# Altium schematic sheet Relay_Schematic_w_headers.SchDoc
size A4; Date: 24/10; Author: Rami Abdelmotalib; DocumentName: Relay circuit
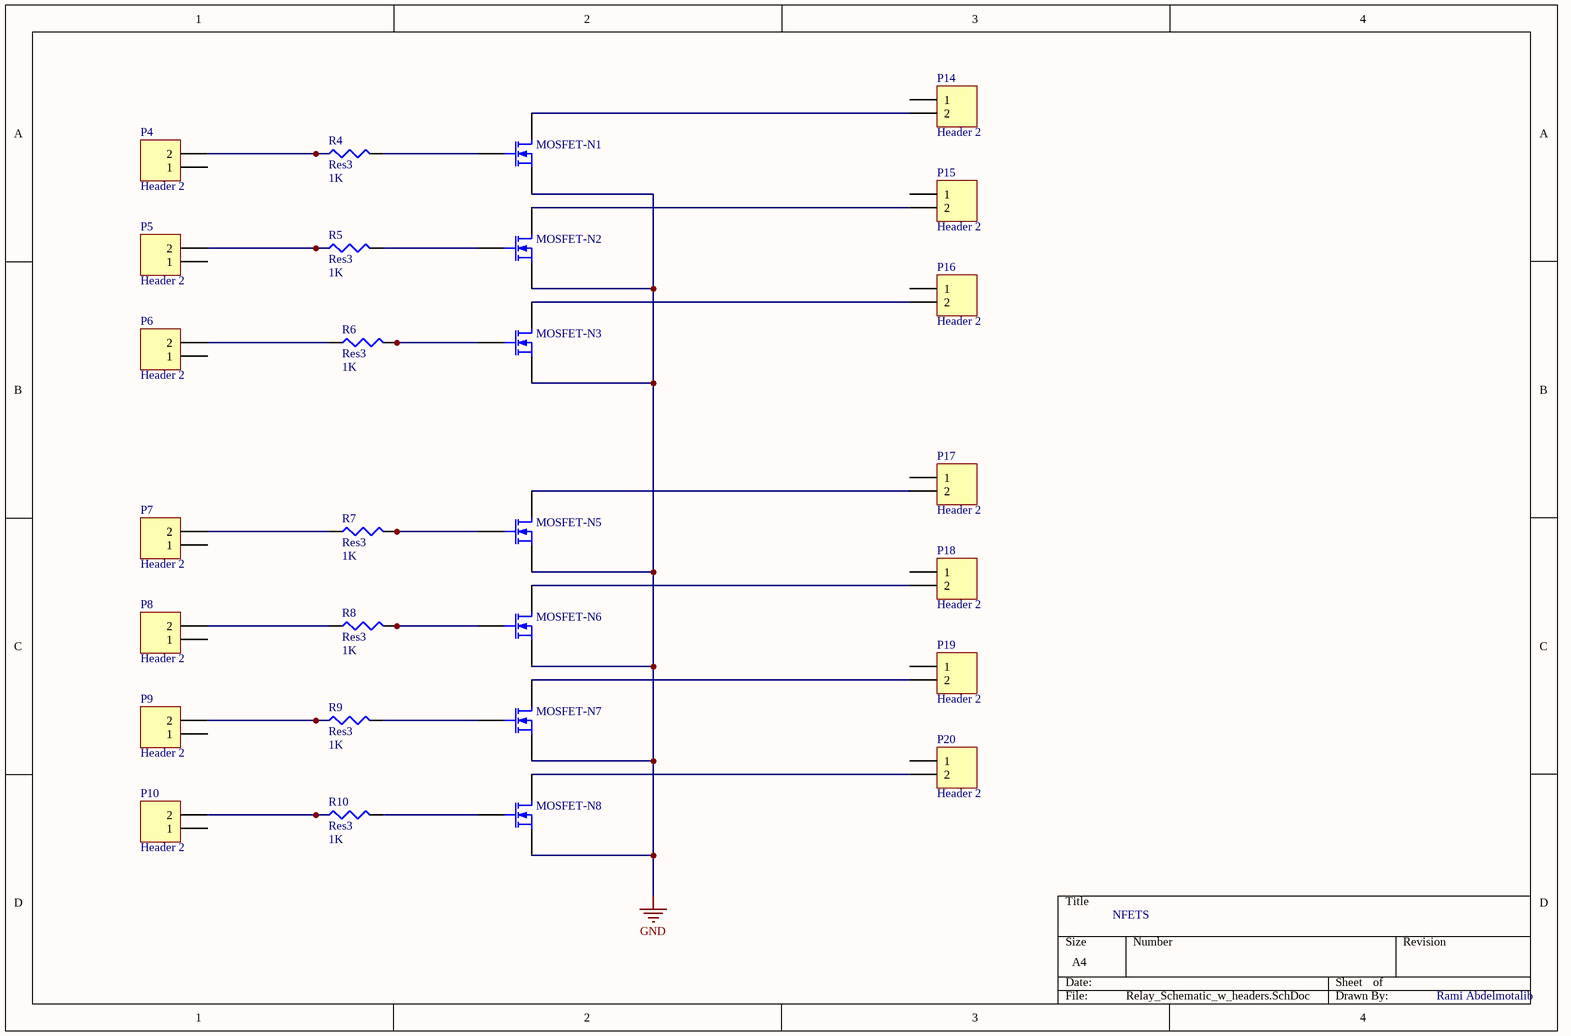
[diagram p0: Relay_Schematic_w_headers.SchDoc]

## Parts
MOSFET-N1  (no value)  [E3]
MOSFET-N2  (no value)  [E3]
MOSFET-N3  (no value)  [E3]
MOSFET-N5  (no value)  [E3]
MOSFET-N6  (no value)  [E3]
MOSFET-N7  (no value)  [E3]
MOSFET-N8  (no value)  [E3]
P4  Header 2  [HDR1X2]
P5  Header 2  [HDR1X2]
P6  Header 2  [HDR1X2]
P7  Header 2  [HDR1X2]
P8  Header 2  [HDR1X2]
P9  Header 2  [HDR1X2]
P10  Header 2  [HDR1X2]
P14  Header 2  [HDR1X2]
P15  Header 2  [HDR1X2]
P16  Header 2  [HDR1X2]
P17  Header 2  [HDR1X2]
P18  Header 2  [HDR1X2]
P19  Header 2  [HDR1X2]
P20  Header 2  [HDR1X2]
R4  Res3  value 1K  [14-1210]
R5  Res3  value 1K  [14-1210]
R6  Res3  value 1K  [14-1210]
R7  Res3  value 1K  [14-1210]
R8  Res3  value 1K  [14-1210]
R9  Res3  value 1K  [14-1210]
R10  Res3  value 1K  [14-1210]

## Nets
GND: MOSFET-N1.3(S) MOSFET-N2.3(S) MOSFET-N3.3(S) MOSFET-N5.3(S) MOSFET-N6.3(S) MOSFET-N7.3(S) MOSFET-N8.3(S)
NetMOSFET-N1_1: MOSFET-N1.1(D) P14.2
NetMOSFET-N1_2: MOSFET-N1.2(G) R4.2
NetMOSFET-N2_1: MOSFET-N2.1(D) P15.2
NetMOSFET-N2_2: MOSFET-N2.2(G) R5.2
NetMOSFET-N3_1: MOSFET-N3.1(D) P16.2
NetMOSFET-N3_2: MOSFET-N3.2(G) R6.2
NetMOSFET-N5_1: MOSFET-N5.1(D) P17.2
NetMOSFET-N5_2: MOSFET-N5.2(G) R7.2
NetMOSFET-N6_1: MOSFET-N6.1(D) P18.2
NetMOSFET-N6_2: MOSFET-N6.2(G) R8.2
NetMOSFET-N7_1: MOSFET-N7.1(D) P19.2
NetMOSFET-N7_2: MOSFET-N7.2(G) R9.2
NetMOSFET-N8_1: MOSFET-N8.1(D) P20.2
NetMOSFET-N8_2: MOSFET-N8.2(G) R10.2
NetP4_2: P4.2 R4.1
NetP5_2: P5.2 R5.1
NetP6_2: P6.2 R6.1
NetP7_2: P7.2 R7.1
NetP8_2: P8.2 R8.1
NetP9_2: P9.2 R9.1
NetP10_2: P10.2 R10.1

Not connected (* = marked no-connect by the designer): P4 1; P5 1; P6 1; P7 1; P8 1; P9 1; P10 1; P14 1; P15 1; P16 1; P17 1; P18 1; P19 1; P20 1

## Notes on the sheet
- NFETS
- Rami Abdelmotalib

## Library data of the parts
MOSFET-N1-MOSFET-N3 MOSFET-N5-MOSFET-N8 = MOSFET-N: N-Channel MOSFET; Published: 8-Jun-2000; LatestRevisionDate: 17-Jul-2002; LatestRevisionNote: Re-released for DXP Platform.; PackageVersion: 1995/1996; PackageReference: E3; Publisher: Altium Limited; PackageDescription: TO, Flat Index; 3 In-Line, Axial Leads; Body Dia. 4.6mm; Lead Dia. 0.5 mm (max)
P4-P10 P14-P20 = Header 2: Header, 2-Pin; LatestRevisionDate: 17-Jul-2002; LatestRevisionNote: Re-released for DXP Platform.; Publisher: Altium Limited
R4-R10 = Res3: Resistor; Published: 8-Jun-2000; LatestRevisionDate: 29-May-2009; LatestRevisionNote: IPC-7351 Footprint Added.; PackageReference: J1-0603; Publisher: Altium Limited; PackageDescription: Chip Resistor